# EAGLE schematic HumiTemp_V2 (EAGLE 6.3)
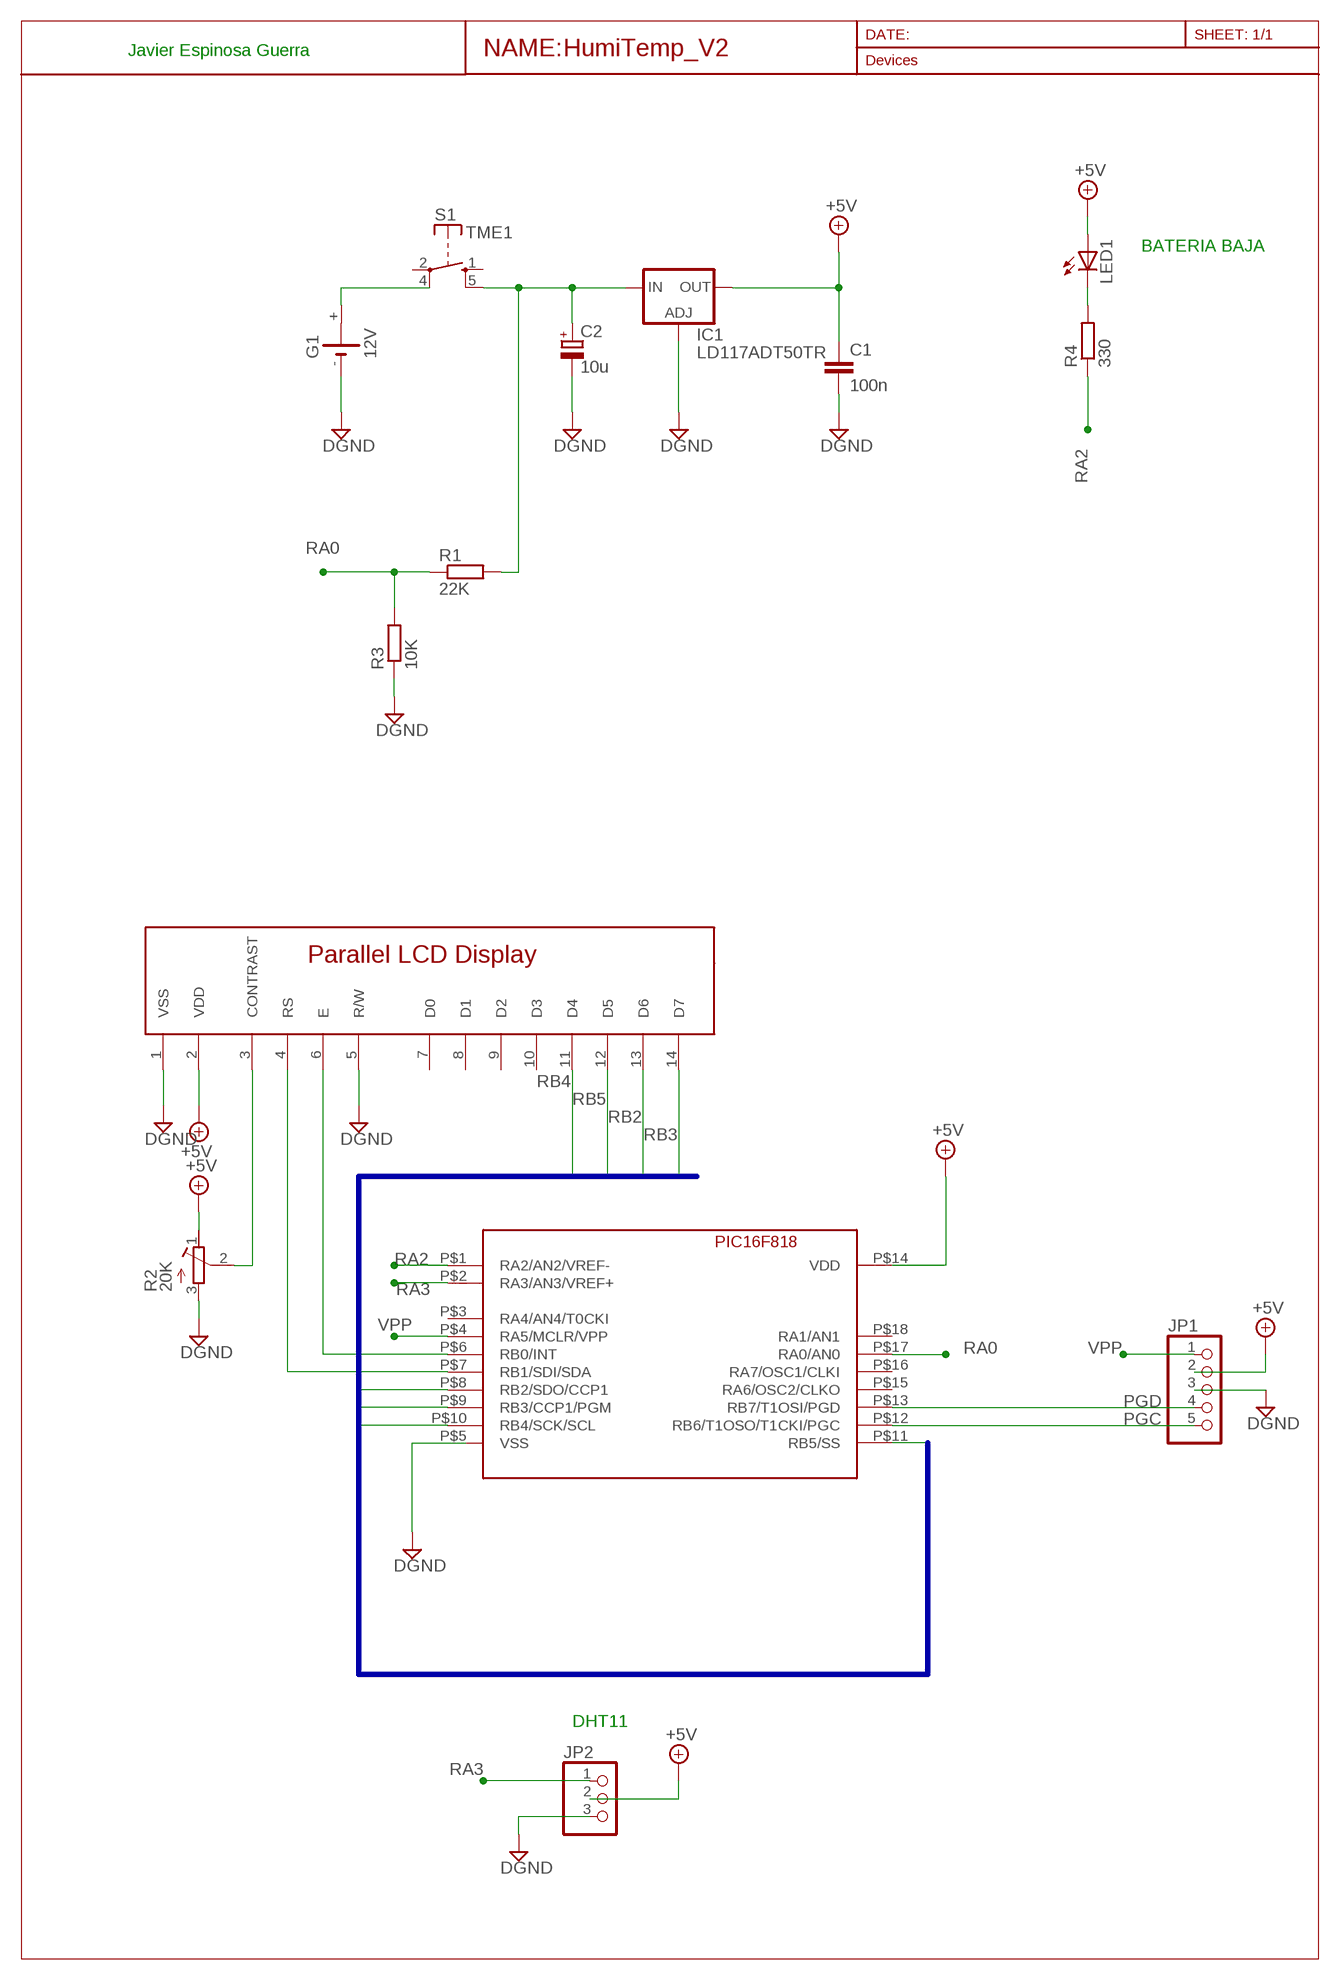
[diagram p0: schematic, sheet 1]

## Parts
C1  100n  C-EU050-024X044  [C050-024X044]
C2  10u  CPOL-EUE2-4  [E2-4]
G1  12V  CRAA  [CRAA]
IC1  LD117ADT50TR  [DPACK]
JP1  PINHD-1X5  [1X05]
JP2  PINHD-1X3  [1X03]
LED1  LED3MM  [LED3MM]
PIC1  PIC16F818  [PIC16F818]
R1  22K  R-EU_R0805  [R0805]
R2  20K  R-TRIMM43P  [RTRIM43P]
R3  10K  R-EU_R0805  [R0805]
R4  330  R-EU_R0805  [R0805]
S1  TME1  [TME1]
U$1  PARALLEL_LCDSIP  [SIP_14]

## Nets
+5V: C1.1 IC1.4(OUT) JP1.2 JP2.2 LED1.A PIC1.P$14(VDD) R2.1(E) U$1.2(VDD)
B$2: PIC1.P$8(RB2/SDO/CCP1)
B$3: PIC1.P$9(RB3/CCP1/PGM)
B$4: PIC1.P$10(RB4/SCK/SCL)
B$5: PIC1.P$11(RB5/SS)
DGND: C1.2 C2.- G1.- IC1.1(ADJ) JP1.3 JP2.3 PIC1.P$5(VSS) R2.3(A) R3.1 U$1.1(VSS) U$1.5(R/W)
N$1: C2.+ IC1.3(IN) R1.2 S1.5(S)
N$2: R2.2(S) U$1.3(CONTRAST)
N$3: PIC1.P$7(RB1/SDI/SDA) U$1.4(RS)
N$4: PIC1.P$6(RB0/INT) U$1.6(E)
N$5: LED1.K(C) R4.2
N$6: G1.+ S1.4(P)
PGC: JP1.5 PIC1.P$12(RB6/T1OSO/T1CKI/PGC)
PGD: JP1.4 PIC1.P$13(RB7/T1OSI/PGD)
RA0: PIC1.P$17(RA0/AN0) R1.1 R3.2
RA2: PIC1.P$1(RA2/AN2/VREF-) R4.1
RA3: JP2.1 PIC1.P$2(RA3/AN3/VREF+)
RB2: U$1.13(D6)
RB3: U$1.14(D7)
RB4: U$1.11(D4)
RB5: U$1.12(D5)
VPP: JP1.1 PIC1.P$4(RA5/MCLR/VPP)
Unconnected: G1.+@1(+) PIC1.P$3(RA4/AN4/T0CKI) PIC1.P$15(RA6/OSC2/CLKO) PIC1.P$16(RA7/OSC1/CLKI) PIC1.P$18(RA1/AN1) S1.1(S) S1.2(P) U$1.7(D0) U$1.8(D1) U$1.9(D2) U$1.10(D3)

## Buses
B$1

## Notes on the sheet
- Javier Espinosa Guerra
- BATERIA BAJA
- DHT11

## Library data of the parts
C1 = rcl:C-EU: CAPACITOR, European symbol
C2 = rcl:CPOL-EU: POLARIZED CAPACITOR, European symbol
G1 = battery:CRAA: LI BATTERY Varta
IC1 = v-reg:LD117A?*: Low drop fixed and adjustable positive voltage regulators 1 A Source: http://www.st.com/stonline/products/literature/ds/7194/ld1117axx.pdf
JP1 = pinhead:PINHD-1X5: PIN HEADER
JP2 = pinhead:PINHD-1X3: PIN HEADER
LED1 = led:LED: LED OSRAM: - CHIPLED LG R971, LG N971, LY N971, LG Q971, LY Q971, LO R971, LY R971 LH N974, LH R974 LS Q976, LO Q976, LY Q976 LO Q996 - Hyper CHIPLED LW Q18S LB Q993, LB Q99A, LB R99A - SideLED LS A670, LO A670, LY A670, LG A670, LP A670 LB A673, LV A673, LT A673, LW A673 LH A674 LY A675 LS A676, LA A676, LO A676, LY A676, LW A676 LS A679, LY A679, LG A679 - Hyper Micro SIDELED® LS Y876, LA Y876, LO Y876, LY Y876 LT Y87S - SmartLED LW L88C, LW L88S LB L89C, LB L89S, LG L890 LS L89K, LO L89K, LY L89K LS L896, LA L896, LO L896, LY L896 - TOPLED LS T670, LO T670, LY T670, LG T670, LP T670 LSG T670, LSP T670, LSY T670, LOP T670, LYG T670 LG T671, LOG T671, LSG T671 LB T673, LV T673, LT T673, LW T673 LH T674 LS T676, LA T676, LO T676, LY T676, LB T676, LH T676, LSB T676, LW T676 LB T67C, LV T67C, LT T67C, LS T67K, LO T67K, LY T67K, LW E67C LS E67B, LA E67B, LO E67B, LY E67B, LB E67C, LV E67C, LT E67C LW T67C LS T679, LY T679, LG T679 LS T770, LO T770, LY T770, LG T770, LP T770 LB T773, LV T773, LT T773, LW T773 LH T774 LS E675, LA E675, LY E675, LS T675 LS T776, LA T776, LO T776, LY T776, LB T776 LHGB T686 LT T68C, LB T68C - Hyper Mini TOPLED® LB M676 - Mini TOPLED Santana® LG M470 LS M47K, LO M47K, LY M47K Source: http://www.osram.convergy.de LUXEON: - LUMILED® LXK2-PW12-R00, LXK2-PW12-S00, LXK2-PW14-U00, LXK2-PW14-V00 LXK2-PM12-R00, LXK2-PM12-S00, LXK2-PM14-U00 LXK2-PE12-Q00, LXK2-PE12-R00, LXK2-PE12-S00, LXK2-PE14-T00, LXK2-PE14-U00 LXK2-PB12-K00, LXK2-PB12-L00, LXK2-PB12-M00, LXK2-PB14-N00, LXK2-PB14-P00, LXK2-PB14-Q00 LXK2-PR12-L00, LXK2-PR12-M00, LXK2-PR14-Q00, LXK2-PR14-R00 LXK2-PD12-Q00, LXK2-PD12-R00, LXK2-PD12-S00 LXK2-PH12-R00, LXK2-PH12-S00 LXK2-PL12-P00, LXK2-PL12-Q00, LXK2-PL12-R00 Source: www.luxeon.com KINGBRIGHT: KA-3528ASYC Source: www.kingbright.com
PIC1 = pic16f818:PIC16F818: Microchipp Component 16F818 Francesco Cuzzupoli virtex2@virgilio.it
R1 R3 R4 = rcl:R-EU_: RESISTOR, European symbol
R2 = rcl:R-TRIMM: Trimm resistor
S1 = switch-misc:TME1: SWITCH
U$1 = lcd_parallel:PARALLEL_LCD: Parallel LCD Alphanumeric LCD's usually common characters x line are 20x4, 2x16